# EAGLE schematic ic74xx-examples (EAGLE 7.7.0)
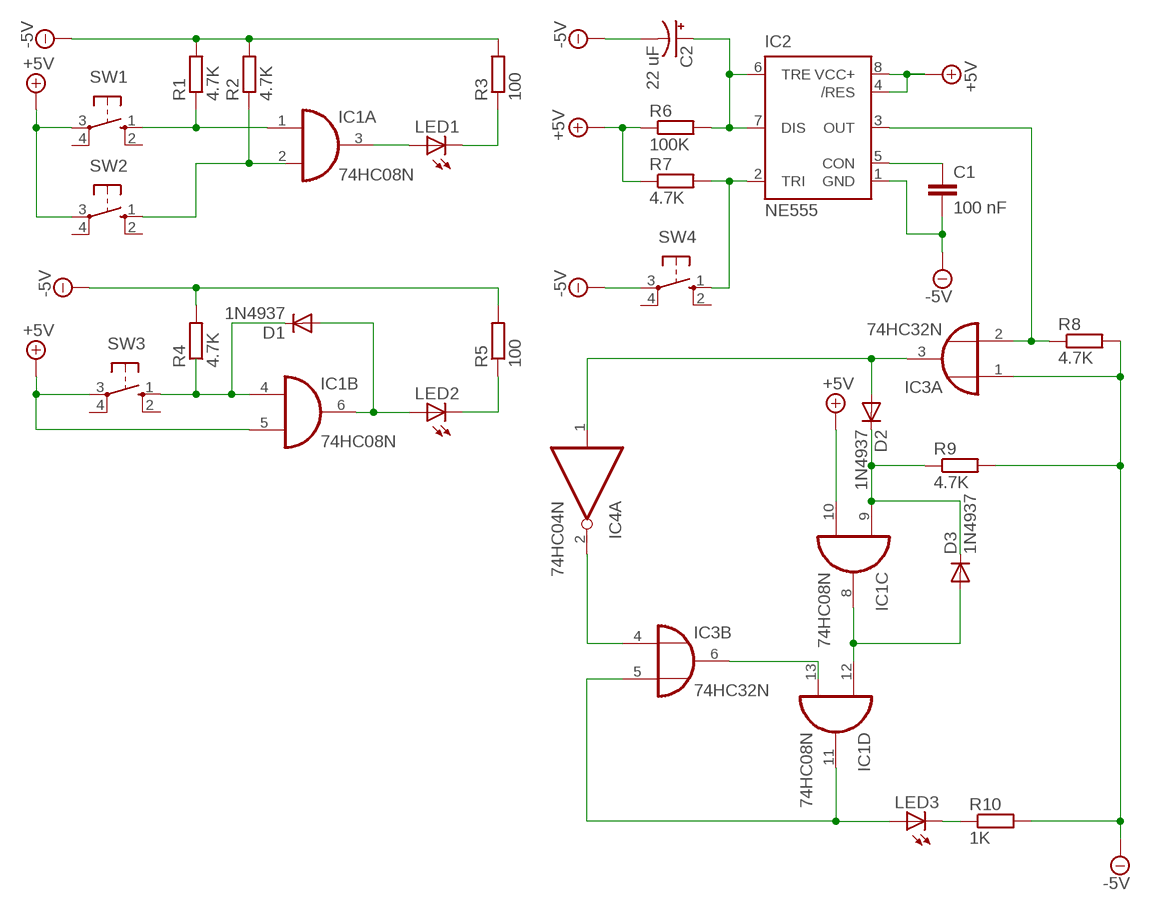
[diagram p0: schematic, sheet 1]

## Parts
C1  100 nF  C2,5-3  [C2.5-3]
C2  22 uF  CPOL-USE2.5-7  [E2,5-7]
D1  1N4937  [DO41-10]
D2  1N4937  [DO41-10]
D3  1N4937  [DO41-10]
IC1  74HC08N  [DIL14]
IC2  NE555  [DIL-08]
IC3  74HC32N  [DIL14]
IC4  74HC04N  [DIL14]
LED1  LED5MM  [LED5MM]
LED2  LED5MM  [LED5MM]
LED3  LED5MM  [LED5MM]
R1  4.7K  R-EU_0411/3V  [0411V]
R2  4.7K  R-EU_0411/3V  [0411V]
R3  100  R-EU_0411/3V  [0411V]
R4  4.7K  R-EU_0411/3V  [0411V]
R5  100  R-EU_0411/3V  [0411V]
R6  100K  R-EU_0411/3V  [0411V]
R7  4.7K  R-EU_0411/3V  [0411V]
R8  4.7K  R-EU_0411/3V  [0411V]
R9  4.7K  R-EU_0411/3V  [0411V]
R10  1K  R-EU_0411/3V  [0411V]
SW1  10-XX  [B3F-10XX]
SW2  10-XX  [B3F-10XX]
SW3  10-XX  [B3F-10XX]
SW4  10-XX  [B3F-10XX]

## Nets
+5V: IC1.5(B:I1) IC1.10(C:I1) IC2.4(/RES) IC2.8(VCC+) R6.1 R7.1 SW1.3(P) SW2.3(P) SW3.3(P)
-5V: C1.2 C2.- IC2.1(GND) IC3.1(A:I0) R1.2 R2.2 R3.2 R4.2 R5.2 R8.2 R9.2 R10.2 SW4.3(P)
N$1: LED1.K(C) R3.1
N$2: IC1.3(A:O) LED1.A
N$3: IC1.1(A:I0) R1.1 SW1.1(S)
N$4: IC1.2(A:I1) R2.1 SW2.1(S)
N$5: D1.C IC1.4(B:I0) R4.1 SW3.1(S)
N$6: LED2.K(C) R5.1
N$7: D1.A IC1.6(B:O) LED2.A
N$8: IC2.2(TRI) R7.2 SW4.1(S)
N$9: C2.+ IC2.6(TRE) IC2.7(DIS) R6.2
N$10: C1.1 IC2.5(CON)
N$11: IC2.3(OUT) IC3.2(A:I1) R8.1
N$12: D2.A IC3.3(A:O)
N$13: D2.C D3.C IC1.9(C:I0) R9.1
N$14: D3.A IC1.8(C:O) IC1.12(D:I0)
N$16: IC3.6(B:O)
N$17: IC1.11(D:O) IC3.5(B:I1) LED3.A
N$18: LED3.K(C)
N$19: IC3.4(B:I0) IC4.2(A:O)
Unconnected: IC1.13(D:I1) IC3.8(C:O) IC3.9(C:I0) IC3.10(C:I1) IC3.11(D:O) IC3.12(D:I0) IC3.13(D:I1) IC4.1(A:I) IC4.3(B:I) IC4.4(B:O) IC4.5(C:I) IC4.6(C:O) IC4.8(D:O) IC4.9(D:I) IC4.10(E:O) IC4.11(E:I) IC4.12(F:O) IC4.13(F:I) R10.1 SW1.2(S1) SW1.4(P1) SW2.2(S1) SW2.4(P1) SW3.2(S1) SW3.4(P1) SW4.2(S1) SW4.4(P1)

## Power pins joined to a net without a drawn wire
GND: IC1.7(P:GND) IC3.7(P:GND) IC4.7(P:GND)
VCC: IC1.14(P:VCC) IC3.14(P:VCC) IC4.14(P:VCC)

## Library data of the parts
C1 = capacitor-wima:C: CAPACITOR naming: grid - package width
C2 = rcl:CPOL-US: POLARIZED CAPACITOR, American symbol
D1-D3 = diode:1N4937: DIODE fast recovery rectifier, 1A
IC1 = 74xx-eu:74*08: Quad 2-input AND gate
IC2 = st-microelectronics:NE555: General purpose bipolar Timer; MF: Arrow Electronics; MPN: NE555N; OC_FARNELL: 1467742; OC_NEWARK: 89K1486
IC3 = 74xx-eu:74*32: Quad 2-input OR gate
IC4 = 74xx-eu:74*04: Hex INVERTER
LED1-LED3 = led:LED: LED OSRAM: - CHIPLED LG R971, LG N971, LY N971, LG Q971, LY Q971, LO R971, LY R971 LH N974, LH R974 LS Q976, LO Q976, LY Q976 LO Q996 - Hyper CHIPLED LW Q18S LB Q993, LB Q99A, LB R99A - SideLED LS A670, LO A670, LY A670, LG A670, LP A670 LB A673, LV A673, LT A673, LW A673 LH A674 LY A675 LS A676, LA A676, LO A676, LY A676, LW A676 LS A679, LY A679, LG A679 - Hyper Micro SIDELED® LS Y876, LA Y876, LO Y876, LY Y876 LT Y87S - SmartLED LW L88C, LW L88S LB L89C, LB L89S, LG L890 LS L89K, LO L89K, LY L89K LS L896, LA L896, LO L896, LY L896 - TOPLED LS T670, LO T670, LY T670, LG T670, LP T670 LSG T670, LSP T670, LSY T670, LOP T670, LYG T670 LG T671, LOG T671, LSG T671 LB T673, LV T673, LT T673, LW T673 LH T674 LS T676, LA T676, LO T676, LY T676, LB T676, LH T676, LSB T676, LW T676 LB T67C, LV T67C, LT T67C, LS T67K, LO T67K, LY T67K, LW E67C LS E67B, LA E67B, LO E67B, LY E67B, LB E67C, LV E67C, LT E67C LW T67C LS T679, LY T679, LG T679 LS T770, LO T770, LY T770, LG T770, LP T770 LB T773, LV T773, LT T773, LW T773 LH T774 LS E675, LA E675, LY E675, LS T675 LS T776, LA T776, LO T776, LY T776, LB T776 LHGB T686 LT T68C, LB T68C - Hyper Mini TOPLED® LB M676 - Mini TOPLED Santana® LG M470 LS M47K, LO M47K, LY M47K Source: http://www.osram.convergy.de LUXEON: - LUMILED® LXK2-PW12-R00, LXK2-PW12-S00, LXK2-PW14-U00, LXK2-PW14-V00 LXK2-PM12-R00, LXK2-PM12-S00, LXK2-PM14-U00 LXK2-PE12-Q00, LXK2-PE12-R00, LXK2-PE12-S00, LXK2-PE14-T00, LXK2-PE14-U00 LXK2-PB12-K00, LXK2-PB12-L00, LXK2-PB12-M00, LXK2-PB14-N00, LXK2-PB14-P00, LXK2-PB14-Q00 LXK2-PR12-L00, LXK2-PR12-M00, LXK2-PR14-Q00, LXK2-PR14-R00 LXK2-PD12-Q00, LXK2-PD12-R00, LXK2-PD12-S00 LXK2-PH12-R00, LXK2-PH12-S00 LXK2-PL12-P00, LXK2-PL12-Q00, LXK2-PL12-R00 Source: www.luxeon.com KINGBRIGHT: KA-3528ASYC Source: www.kingbright.com
R1-R10 = resistor:R-EU_: RESISTOR, European symbol
SW1-SW4 = buttons:10-XX: OMRON SWITCH